# EAGLE design mega128-brd (EAGLE 6.4)
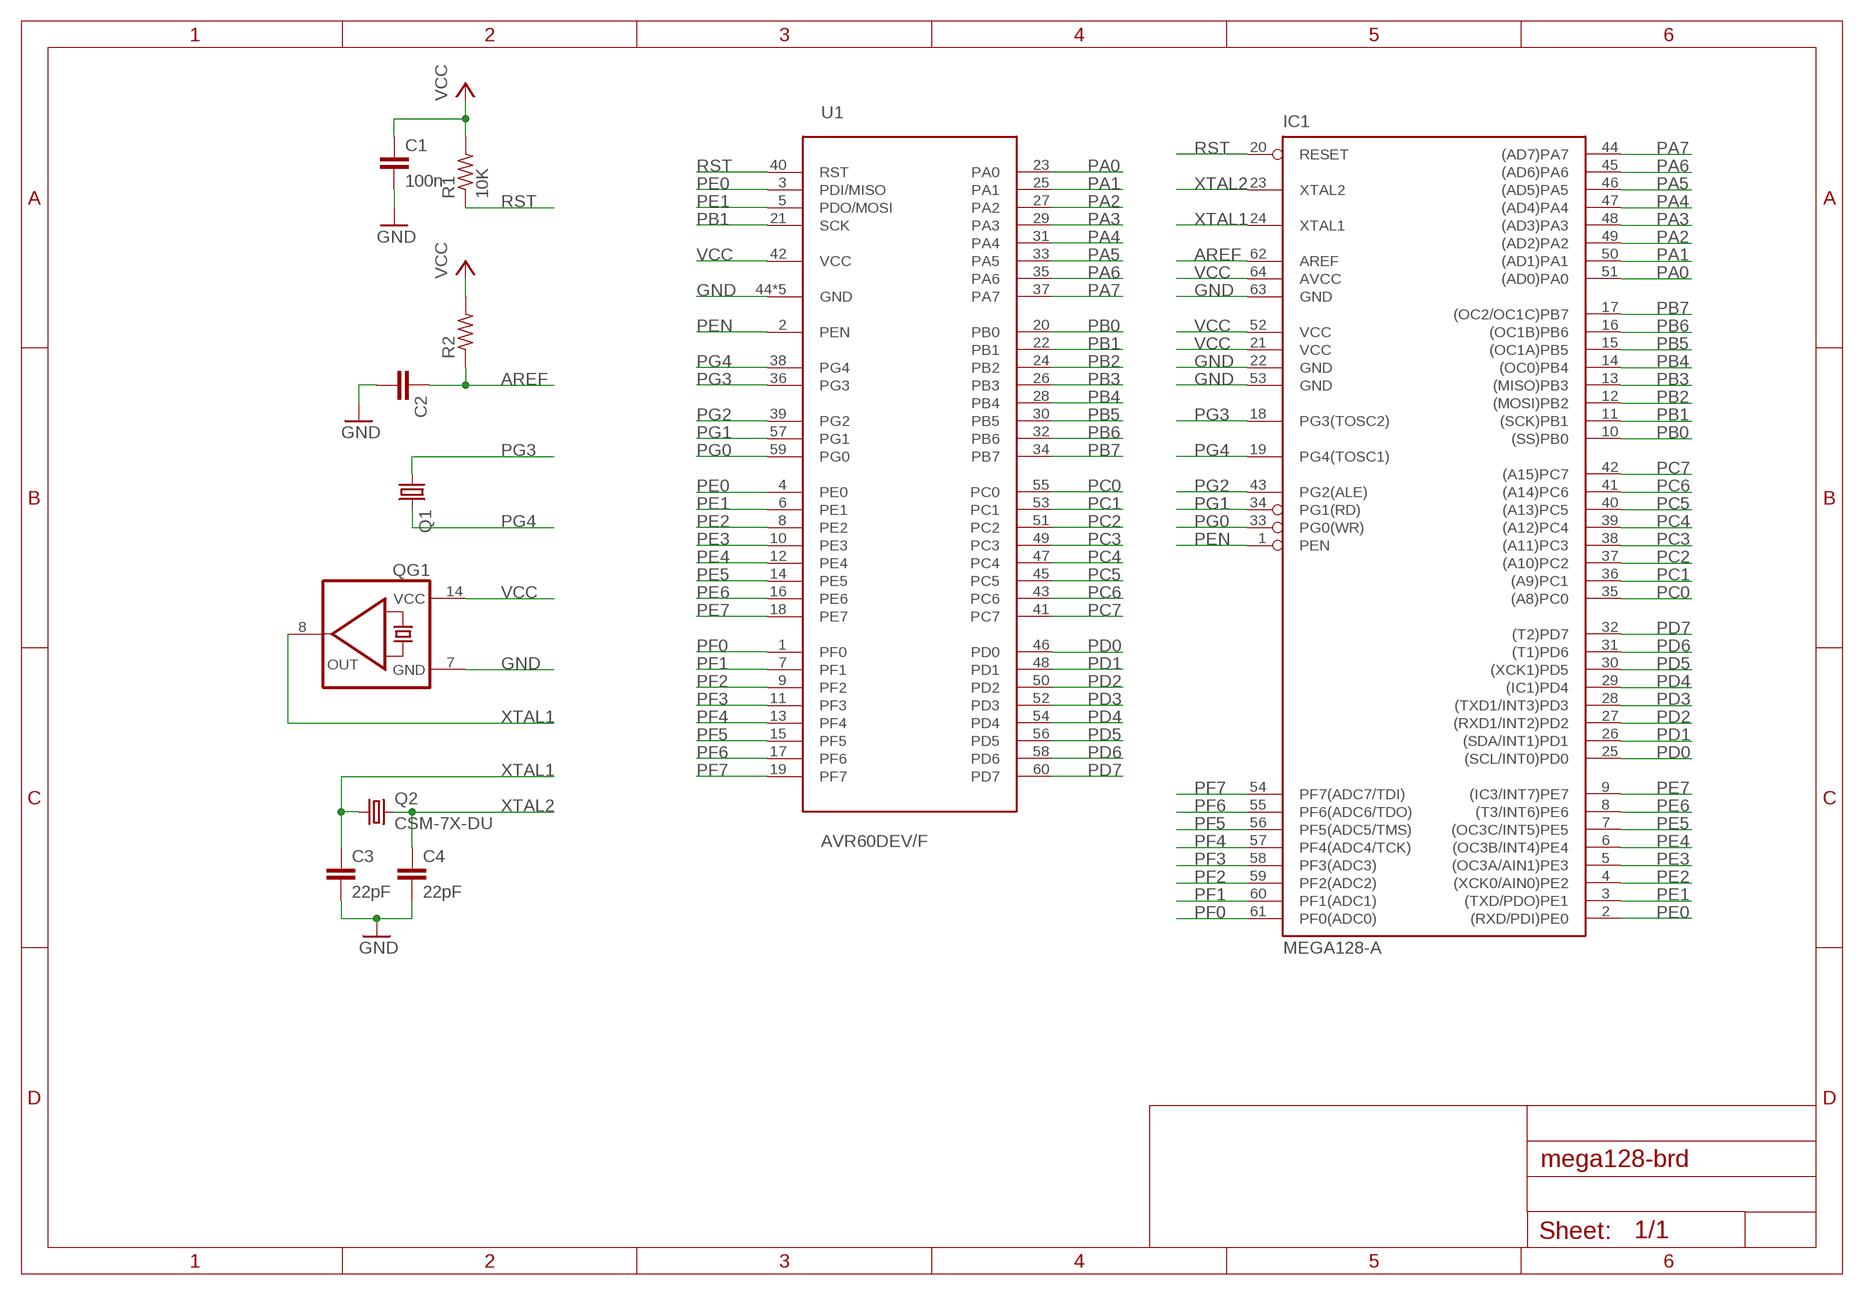
[diagram p0: schematic, sheet 1]

## Parts
C1  100n  C-EUC0805  [C0805]
C2  C-EUC0805  [C0805]
C3  22pF  C-EUC0805  [C0805]
C4  22pF  C-EUC0805  [C0805]
IC1  MEGA128-A  [TQFP64]
Q1  CRYSTALTC26V  [TC26V]
Q2  CSM-7X-DU  [CSM-7X-DU]
QG1  QG5860  [DIL14S]
R1  10K  R-US_R0805  [R0805]
R2  R-US_R0805  [R0805]
U1  AVR60DEV/F  [AVR60-DEV]

## Nets
AREF: C2.1 IC1.62(AREF) R2.1
GND: C1.2 C2.2 C3.2 C4.2 IC1.22(GND) IC1.53(GND) IC1.63(GND) QG1.7(GND) U1.44(GND) U1.61(GND) U1.62(GND) U1.63(GND) U1.64(GND)
PA0: IC1.51((AD0)PA0) U1.23(PA0)
PA1: IC1.50((AD1)PA1) U1.25(PA1)
PA2: IC1.49((AD2)PA2) U1.27(PA2)
PA3: IC1.48((AD3)PA3) U1.29(PA3)
PA4: IC1.47((AD4)PA4) U1.31(PA4)
PA5: IC1.46((AD5)PA5) U1.33(PA5)
PA6: IC1.45((AD6)PA6) U1.35(PA6)
PA7: IC1.44((AD7)PA7) U1.37(PA7)
PB0: IC1.10((SS)PB0) U1.20(PB0)
PB1: IC1.11((SCK)PB1) U1.21(SCK) U1.22(PB1)
PB2: IC1.12((MOSI)PB2) U1.24(PB2)
PB3: IC1.13((MISO)PB3) U1.26(PB3)
PB4: IC1.14((OC0)PB4) U1.28(PB4)
PB5: IC1.15((OC1A)PB5) U1.30(PB5)
PB6: IC1.16((OC1B)PB6) U1.32(PB6)
PB7: IC1.17((OC2/OC1C)PB7) U1.34(PB7)
PC0: IC1.35((A8)PC0) U1.55(PC0)
PC1: IC1.36((A9)PC1) U1.53(PC1)
PC2: IC1.37((A10)PC2) U1.51(PC2)
PC3: IC1.38((A11)PC3) U1.49(PC3)
PC4: IC1.39((A12)PC4) U1.47(PC4)
PC5: IC1.40((A13)PC5) U1.45(PC5)
PC6: IC1.41((A14)PC6) U1.43(PC6)
PC7: IC1.42((A15)PC7) U1.41(PC7)
PD0: IC1.25((SCL/INT0)PD0) U1.46(PD0)
PD1: IC1.26((SDA/INT1)PD1) U1.48(PD1)
PD2: IC1.27((RXD1/INT2)PD2) U1.50(PD2)
PD3: IC1.28((TXD1/INT3)PD3) U1.52(PD3)
PD4: IC1.29((IC1)PD4) U1.54(PD4)
PD5: IC1.30((XCK1)PD5) U1.56(PD5)
PD6: IC1.31((T1)PD6) U1.58(PD6)
PD7: IC1.32((T2)PD7) U1.60(PD7)
PE0: IC1.2((RXD/PDI)PE0) U1.3(PDI/MISO) U1.4(PE0)
PE1: IC1.3((TXD/PDO)PE1) U1.5(PDO/MOSI) U1.6(PE1)
PE2: IC1.4((XCK0/AIN0)PE2) U1.8(PE2)
PE3: IC1.5((OC3A/AIN1)PE3) U1.10(PE3)
PE4: IC1.6((OC3B/INT4)PE4) U1.12(PE4)
PE5: IC1.7((OC3C/INT5)PE5) U1.14(PE5)
PE6: IC1.8((T3/INT6)PE6) U1.16(PE6)
PE7: IC1.9((IC3/INT7)PE7) U1.18(PE7)
PEN: IC1.1(PEN) U1.2(PEN)
PF0: IC1.61(PF0(ADC0)) U1.1(PF0)
PF1: IC1.60(PF1(ADC1)) U1.7(PF1)
PF2: IC1.59(PF2(ADC2)) U1.9(PF2)
PF3: IC1.58(PF3(ADC3)) U1.11(PF3)
PF4: IC1.57(PF4(ADC4/TCK)) U1.13(PF4)
PF5: IC1.56(PF5(ADC5/TMS)) U1.15(PF5)
PF6: IC1.55(PF6(ADC6/TDO)) U1.17(PF6)
PF7: IC1.54(PF7(ADC7/TDI)) U1.19(PF7)
PG0: IC1.33(PG0(WR)) U1.59(PG0)
PG1: IC1.34(PG1(RD)) U1.57(PG1)
PG2: IC1.43(PG2(ALE)) U1.39(PG2)
PG3: IC1.18(PG3(TOSC2)) Q1.1 U1.36(PG3)
PG4: IC1.19(PG4(TOSC1)) Q1.2 U1.38(PG4)
RST: IC1.20(RESET) R1.1 U1.40(RST)
VCC: C1.1 IC1.21(VCC) IC1.52(VCC) IC1.64(AVCC) QG1.14(VCC) R1.2 R2.2 U1.42(VCC)
XTAL1: C3.1 IC1.24(XTAL1) Q2.1 QG1.8(OUT)
XTAL2: C4.1 IC1.23(XTAL2) Q2.2

## Library data of the parts
C1-C4 = rcl:C-EU: CAPACITOR, European symbol
IC1 = atmel:MEGA128: MICROCONTROLLER 128 Kbytes FLASH 4 Kbytes SRAM 4 Kbytes EEPROM DUAL USART 8-channel 10 bit ADC Source: avr.lbr; MPN: ATMEGA128-16AU; OC_FARNELL: 9171118; OC_NEWARK: 95K7364
Q1 = crystal:CRYSTAL: CRYSTAL; OC_FARNELL: unknown; OC_NEWARK: unknown
Q2 = crystal:CSM-7X-DU: SMD CRYSTAL Source: www.ecsxtal.com .. Crystal 3.6864MHz CSM_7X_DU.PDF; OC_FARNELL: unknown; OC_NEWARK: unknown
QG1 = crystal:QG5860: CRYSTAL RESONATOR; OC_FARNELL: unknown; OC_NEWARK: unknown
R1 R2 = rcl:R-US_: RESISTOR, American symbol
U1 = IyunLib:AVR60

## Board
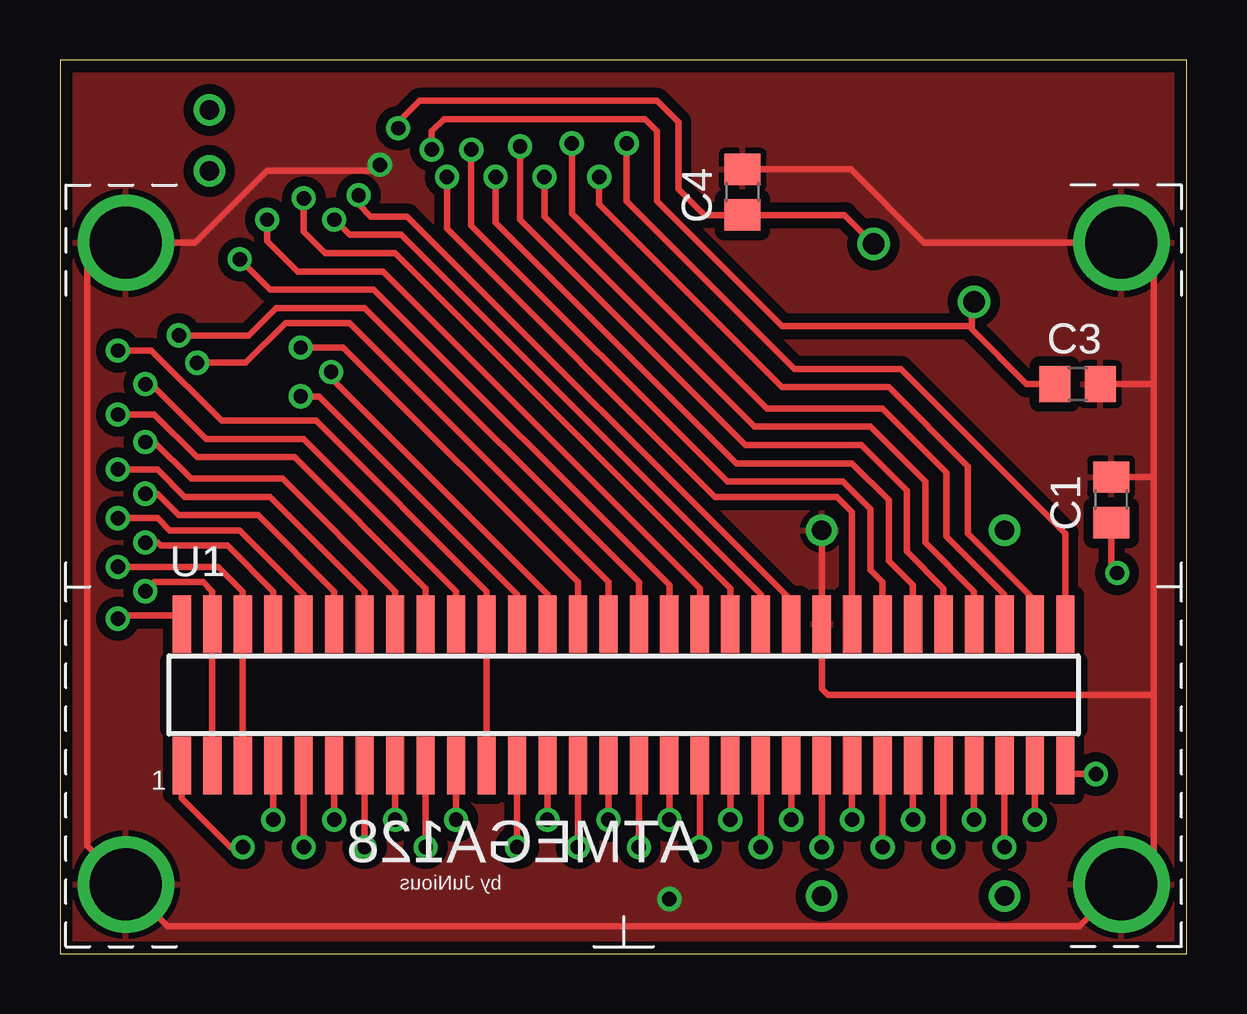
[diagram p1: board, top side]
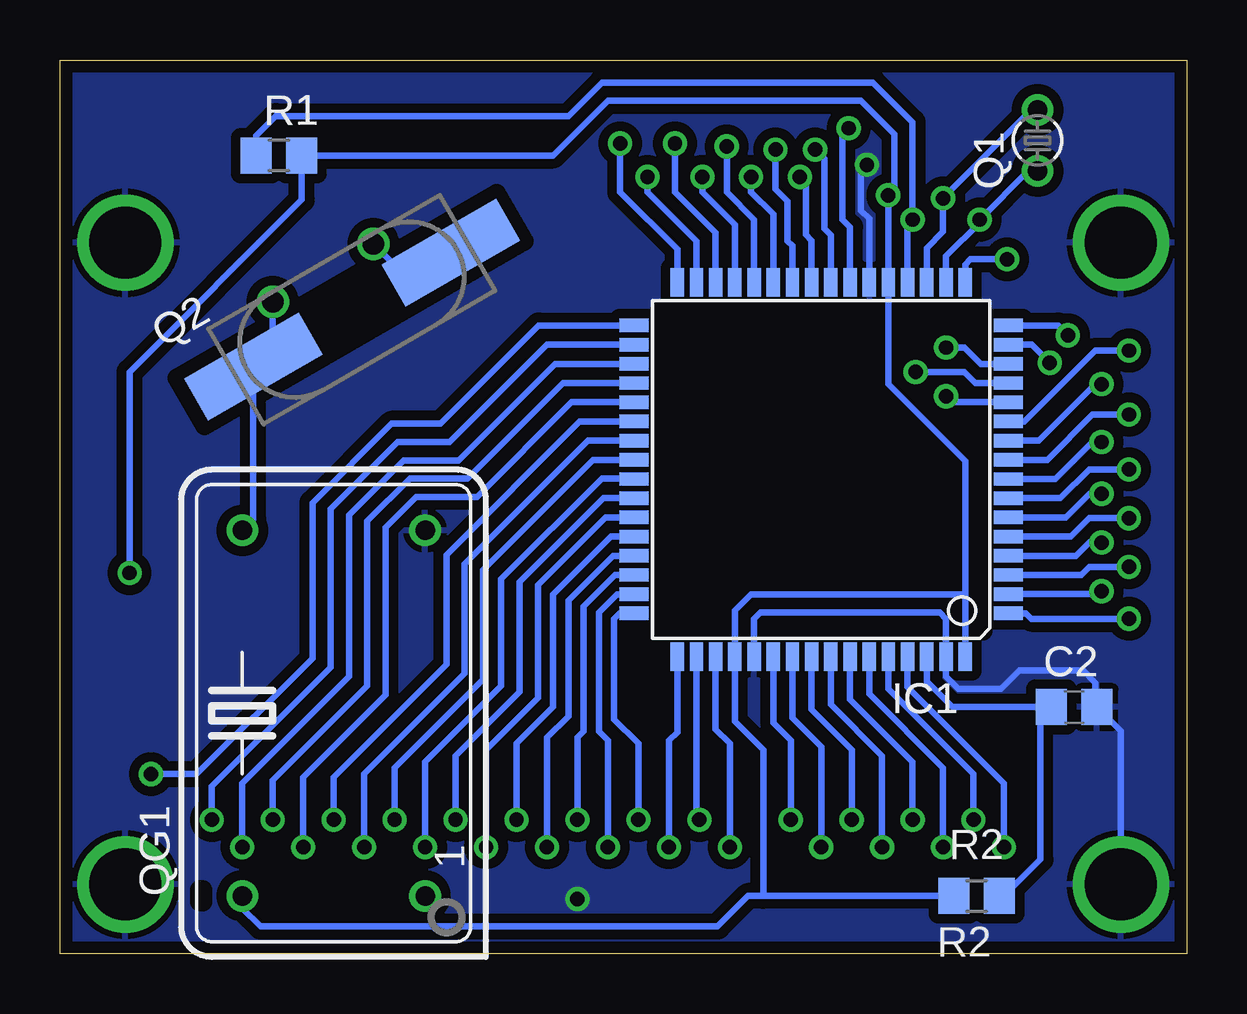
[diagram p2: board, bottom side, seen from below]

Size 46.97 x 37.26 mm. Coordinates in mm from the lower left corner, seen from the top.
Outline: 0,0 46.97,0 46.97,37.26 0,37.26 0,0
Copper layers (1*16): Top 0.035mm / dielectric 1.5mm / Bottom 0.035mm
Design rules "default *": minimum track width 10mil, minimum drill 20mil, track to track 10mil, track to pad 10mil, pad to pad 10mil, via to via 10mil, smd to smd 8mil, copper to edge 20mil, drill to drill 8mil, minimum pad ring 10mil, minimum via ring 8mil, stop-mask expansion 4mil, vias tented up to drill 0mil, thermal gap 10mil
tRestrict: area 4.6,9.4 to 42.4,12.2
bRestrict: area 8.5,13.5 to 22,26.8; area 41,2.2 to 41.1,2.7; area 27.6,22 to 42.1,31.7

### Footprints (pad centres in the part's own frame; a part is rotated, then mirrored left to right if it is on the bottom)
C0805 = smd 1.3 x 1.5: 1 -0.95,0; 2 0.95,0
TQFP64 = smd 1.194 x 0.559: 1 -7.8,6; 2 -7.8,5.2; 3 -7.8,4.4; 4 -7.8,3.6; 5 -7.8,2.8; 6 -7.8,2; 7 -7.8,1.2; 8 -7.8,0.4; 9 -7.8,-0.4; 10 -7.8,-1.2; 11 -7.8,-2; 12 -7.8,-2.8; 13 -7.8,-3.6; 14 -7.8,-4.4; 15 -7.8,-5.2; 16 -7.8,-6; 33 7.8,-6; 34 7.8,-5.2; 35 7.8,-4.4; 36 7.8,-3.6; 37 7.8,-2.8; 38 7.8,-2; 39 7.8,-1.2; 40 7.8,-0.4; 41 7.8,0.4; 42 7.8,1.2; 43 7.8,2; 44 7.8,2.8; 45 7.8,3.6; 46 7.8,4.4; 47 7.8,5.2; 48 7.8,6 | smd 0.559 x 1.194: 17 -6,-7.8; 18 -5.2,-7.8; 19 -4.4,-7.8; 20 -3.6,-7.8; 21 -2.8,-7.8; 22 -2,-7.8; 23 -1.2,-7.8; 24 -0.4,-7.8; 25 0.4,-7.8; 26 1.2,-7.8; 27 2,-7.8; 28 2.8,-7.8; 29 3.6,-7.8; 30 4.4,-7.8; 31 5.2,-7.8; 32 6,-7.8; 49 6,7.8; 50 5.2,7.8; 51 4.4,7.8; 52 3.6,7.8; 53 2.8,7.8; 54 2,7.8; 55 1.2,7.8; 56 0.4,7.8; 57 -0.4,7.8; 58 -1.2,7.8; 59 -2,7.8; 60 -2.8,7.8; 61 -3.6,7.8; 62 -4.4,7.8; 63 -5.2,7.8; 64 -6,7.8
TC26V = drill 0.813: 1 -1.27,0; 2 1.27,0
CSM-7X-DU = smd 5.5 x 2: 1 -4.75,0; 2 4.75,0
DIL14S = drill 0.813: 1 -7.62,-3.81; 7 7.62,-3.81; 8 7.62,3.81; 14 -7.62,3.81
R0805 = smd 1.3 x 1.5: 1 -0.95,0; 2 0.95,0
AVR60-DEV = smd 0.76 x 2.4: 1 -18.415,-2.95; 2 -18.415,2.95; 3 -17.145,-2.95; 4 -17.145,2.95; 5 -15.875,-2.95; 6 -15.875,2.95; 7 -14.605,-2.95; 8 -14.605,2.95; 9 -13.335,-2.95; 10 -13.335,2.95; 11 -12.065,-2.95; 12 -12.065,2.95; 13 -10.795,-2.95; 14 -10.795,2.95; 15 -9.525,-2.95; 16 -9.525,2.95; 17 -8.255,-2.95; 18 -8.255,2.95; 19 -6.985,-2.95; 20 -6.985,2.95; 21 -5.715,-2.95; 22 -5.715,2.95; 23 -4.445,-2.95; 24 -4.445,2.95; 25 -3.175,-2.95; 26 -3.175,2.95; 27 -1.905,-2.95; 28 -1.905,2.95; 29 -0.635,-2.95; 30 -0.635,2.95; 31 0.635,-2.95; 32 0.635,2.95; 33 1.905,-2.95; 34 1.905,2.95; 35 3.175,-2.95; 36 3.175,2.95; 37 4.445,-2.95; 38 4.445,2.95; 39 5.715,-2.95; 40 5.715,2.95; 41 6.985,-2.95; 42 6.985,2.95; 43 8.255,-2.95; 44 8.255,2.95; 45 9.525,-2.95; 46 9.525,2.95; 47 10.795,-2.95; 48 10.795,2.95; 49 12.065,-2.95; 50 12.065,2.95; 51 13.335,-2.95; 52 13.335,2.95; 53 14.605,-2.95; 54 14.605,2.95; 55 15.875,-2.95; 56 15.875,2.95; 57 17.145,-2.95; 58 17.145,2.95; 59 18.415,-2.95; 60 18.415,2.95 | drill 3: 61 20.75,-7.9; 62 -20.75,-7.9; 63 -20.75,18.85; 64 20.75,18.85

### Placement (x,y rotation side)
C1  43.81,18.92 90 top
C2  4.7,10.29 0 bottom
C3  42.42,23.75 0 top
C4  28.45,31.75 90 top
IC1  15.24,20.19 180 bottom
Q1  6.22,33.91 90 bottom
Q2  34.8,26.86 30 bottom
QG1  35.56,10.03 90 bottom
R1  37.85,33.27 0 bottom
R2  8.76,2.41 180 bottom
U1  23.5,10.79 0 top

### Tracks (layer width: path | path; a pad name or v marks a point on that pad's centre or on a via)
AREF
  Bottom 0.28: C2.1 6.22,10.29 | 6.22,10.29 9.78,10.29 10.84,11.35 IC1.62 | R2.1 7.62,2.41 6.1,3.94 6.1,10.16 6.22,10.29
GND  (via drill 0.6)
  Top 0.28: 45.59,23.88 45.59,28.7 44.65,29.64 U1.64 36.01,29.64 32.96,32.7 C4.2 | 45.59,23.88 45.59,19.94 | 45.59,19.94 45.59,10.79 | 45.59,10.79 45.59,4.24 U1.61 42.49,1.14 4.5,1.14 U1.62 1.14,4.5 1.14,28.57 2.21,29.64 U1.63 5.64,29.64 8.64,32.64 13.08,32.64 v13.34,32.89 | C3.2 45.47,23.75 45.59,23.88 | C1.2 45.53,19.87 45.59,19.94 | 45.59,10.79 32,10.79 31.75,11.05 U1.44 QG1.7
  Bottom 0.28: IC1.53 18.04,13.33 18.03,13.34 18.03,13.97 17.78,14.22 10.29,14.22 10.03,13.97 IC1.63 | IC1.63 | IC1.63 10.03,11.56 9.53,11.05 7.75,11.05 6.99,11.81 4.32,11.81 3.81,11.3 3.81,10.35 C2.2 2.75,9.28 U1.62 | IC1.22 13.24,30.64 13.59,30.99 13.59,32.64 v13.34,32.89
  other vias: 25.4,2.29
  pour Top (isolate 0.406): 0.25,36.96 46.74,36.96 46.74,0.25 0.25,0.25
  pour Bottom (isolate 0.406): 0.25,36.96 46.74,36.96 46.74,0.25 0.25,0.25
PA0  (via drill 0.6)
  Top 0.28: U1.23 v19.05,4.45
  Bottom 0.28: v19.05,4.45 19.05,8.76 19.64,9.35 IC1.51
PA1  (via drill 0.6)
  Top 0.28: U1.25 v20.32,5.59
  Bottom 0.28: v20.32,5.59 20.44,5.71 IC1.50
PA2  (via drill 0.6)
  Top 0.28: U1.27 v21.59,4.45
  Bottom 0.28: v21.59,4.45 21.59,8.89 21.24,9.24 IC1.49
PA3  (via drill 0.6)
  Top 0.28: U1.29 v22.86,5.59
  Bottom 0.28: v22.86,5.59 22.86,8.76 23.88,9.78 23.88,13.97 23.65,14.19 IC1.48
PA4  (via drill 0.6)
  Top 0.28: U1.31 v24.13,4.45
  Bottom 0.28: v24.13,4.45 24.13,8.89 24.51,9.27 24.51,14.22 23.75,14.99 IC1.47
PA5  (via drill 0.6)
  Top 0.28: U1.33 v25.4,5.59
  Bottom 0.28: v25.4,5.59 25.4,9.02 25.15,9.27 25.15,14.48 23.83,15.79 IC1.46
PA6  (via drill 0.6)
  Top 0.28: U1.35 v26.67,4.45
  Bottom 0.28: v26.67,4.45 26.67,9.02 25.78,9.91 25.78,14.73 23.92,16.59 IC1.45
PA7  (via drill 0.6)
  Top 0.28: U1.37 v27.94,5.59
  Bottom 0.28: v27.94,5.59 27.94,8.76 26.42,10.29 26.42,14.99 24.01,17.39 IC1.44
PB0  (via drill 0.6)
  Top 0.28: v3.56,23.75 3.81,23.75 6.1,21.46 10.16,21.46 16.51,15.11 U1.20
  Bottom 0.28: IC1.10 6.17,21.39 3.81,23.75 v3.56,23.75
PB1  (via drill 0.6)
  Top 0.28: U1.21 U1.22 17.78,15.11 10.67,22.23 6.73,22.23 3.81,25.15 v2.41,25.15
  Bottom 0.28: IC1.11 6.76,22.19 3.81,25.15 v2.41,25.15
PB2  (via drill 0.6)
  Top 0.28: v10.03,23.24 10.79,23.24 19.05,14.99 U1.24
  Bottom 0.28: IC1.12 9.79,22.99 v10.03,23.24
PB3  (via drill 0.6)
  Top 0.28: U1.26 20.32,14.99 11.3,24 v11.3,24.26
  Bottom 0.28: v11.3,24.26 9.27,24.26 8.81,23.79 IC1.13
PB4  (via drill 0.6)
  Top 0.28: U1.28 21.59,15.49 11.81,25.27 v10.03,25.27
  Bottom 0.28: IC1.14 8.59,24.59 9.27,25.27 v10.03,25.27
PB5  (via drill 0.6)
  Top 0.28: v5.71,24.64 7.75,24.64 9.4,26.29 12.06,26.29 22.86,15.49 U1.30
  Bottom 0.28: IC1.15 6.47,25.39 v5.71,24.64
PB6  (via drill 0.6)
  Top 0.28: v4.95,25.78 7.87,25.78 9.02,26.92 12.7,26.92 24.13,15.49 U1.32
  Bottom 0.28: IC1.16 5.37,26.19 v4.95,25.78
PB7  (via drill 0.6)
  Top 0.28: U1.34 25.4,15.37 13.08,27.69 8.76,27.69 v7.49,28.96
  Bottom 0.28: IC1.17 9.24,28.73 9.02,28.96 v7.49,28.96
PC0  (via drill 0.6)
  Top 0.28: U1.55 v39.37,4.45
  Bottom 0.28: v39.37,4.45 39.37,7.11 34.92,11.56 34.92,18.29 32.64,20.57 30.35,20.57 26.33,24.59 IC1.35
PC1  (via drill 0.6)
  Top 0.28: U1.53 v38.1,5.59
  Bottom 0.28: v38.1,5.59 38.1,7.24 34.16,11.18 34.16,18.03 32.38,19.81 29.97,19.81 25.99,23.79 IC1.36
PC2  (via drill 0.6)
  Top 0.28: U1.51 v36.83,4.45
  Bottom 0.28: v36.83,4.45 36.83,7.37 33.4,10.79 33.4,17.78 32.13,19.05 29.59,19.05 25.65,22.99 IC1.37
PC3  (via drill 0.6)
  Top 0.28: U1.49 v35.56,5.59
  Bottom 0.28: v35.56,5.59 35.56,7.37 30.86,12.06 30.86,16.64 25.3,22.19 IC1.38
PC4  (via drill 0.6)
  Top 0.28: U1.47 v34.29,4.45
  Bottom 0.28: v34.29,4.45 34.29,7.49 30.1,11.68 30.1,16.26 24.96,21.39 IC1.39
PC5  (via drill 0.6)
  Top 0.28: U1.45 v33.02,5.59
  Bottom 0.28: v33.02,5.59 33.02,7.75 29.34,11.43 29.34,16 24.75,20.59 IC1.40
PC6  (via drill 0.6)
  Top 0.28: U1.43 v31.75,4.45
  Bottom 0.28: v31.75,4.45 31.75,8 28.57,11.18 28.57,15.62 24.38,19.81 23.06,19.81 IC1.41
PC7  (via drill 0.6)
  Top 0.28: U1.41 v30.48,5.59
  Bottom 0.28: v30.48,5.59 30.48,8.26 27.81,10.92 27.81,15.49 24.31,18.99 IC1.42
PD0  (via drill 0.6)
  Top 0.28: v16.13,32.38 16.13,30.23 27.3,19.05 32.38,19.05 33.02,18.41 U1.46
  Bottom 0.28: IC1.25 15.64,29.74 15.88,29.97 15.88,32.13 v16.13,32.38
PD1  (via drill 0.6)
  Top 0.28: v17.14,33.53 17.14,30.35 27.81,19.68 32.64,19.68 33.78,18.54 33.78,16 34.29,15.49 U1.48
  Bottom 0.28: v17.14,33.53 17.14,31.88 16.64,31.37 16.64,29.72 16.44,29.52 IC1.26
PD2  (via drill 0.6)
  Top 0.28: v18.16,32.38 18.16,30.48 28.19,20.45 33.02,20.45 34.54,18.92 34.54,16.38 35.56,15.37 U1.50
  Bottom 0.28: v18.16,32.38 18.16,31.75 17.24,30.83 IC1.27
PD3  (via drill 0.6)
  Top 0.28: v19.18,33.66 19.18,30.61 28.57,21.21 33.4,21.21 35.31,19.3 35.31,16.76 36.83,15.24 U1.52
  Bottom 0.28: v19.18,33.66 19.18,31.75 18.04,30.61 IC1.28
PD4  (via drill 0.6)
  Top 0.28: v20.19,32.38 20.19,30.73 28.96,21.97 33.78,21.97 36.07,19.68 36.07,17.14 38.1,15.11 U1.54
  Bottom 0.28: v20.19,32.38 20.19,31.75 18.84,30.4 IC1.29
PD5  (via drill 0.6)
  Top 0.28: U1.56 39.37,14.99 36.96,17.4 36.96,20.07 34.29,22.73 29.46,22.73 21.34,30.86 v21.34,33.78
  Bottom 0.28: v21.34,33.78 21.34,31.75 19.64,30.05 IC1.30
PD6  (via drill 0.6)
  Top 0.28: U1.58 40.64,14.73 37.85,17.53 37.85,20.32 34.54,23.62 30.1,23.62 22.48,31.24 v22.48,32.38
  Bottom 0.28: v22.48,32.38 22.48,31.75 20.44,29.71 IC1.31
PD7  (via drill 0.6)
  Top 0.28: U1.60 41.91,17.53 35.05,24.38 30.61,24.38 23.62,31.37 v23.62,33.78
  Bottom 0.28: v23.62,33.78 23.62,31.75 21.24,29.37 IC1.32
PE0  (via drill 0.6)
  Top 0.28: U1.3 U1.4 6.35,15.11 5.97,15.49 3.94,15.49 v3.56,15.11
  Bottom 0.28: v3.56,15.11 3.68,14.99 IC1.2
PE1  (via drill 0.6)
  Top 0.28: U1.5 U1.6 7.62,15.11 6.6,16.13 v2.41,16.13
  Bottom 0.28: IC1.3 4.4,15.79 4.06,16.13 v2.41,16.13
PE2  (via drill 0.6)
  Top 0.28: U1.8 8.89,15.11 6.99,17.02 4.19,17.02 4.06,17.14 v3.56,17.14
  Bottom 0.28: IC1.4 4.62,16.59 4.06,17.14 v3.56,17.14
PE3  (via drill 0.6)
  Top 0.28: U1.10 10.16,14.99 7.49,17.65 4.57,17.65 4.06,18.16 v2.41,18.16
  Bottom 0.28: IC1.5 4.83,17.39 4.06,18.16 v2.41,18.16
PE4  (via drill 0.6)
  Top 0.28: U1.12 11.43,15.11 8.26,18.29 4.95,18.29 4.06,19.18 v3.56,19.18
  Bottom 0.28: IC1.6 5.05,18.19 4.06,19.18 v3.56,19.18
PE5  (via drill 0.6)
  Top 0.28: v2.41,20.19 4.06,20.19 5.21,19.05 8.76,19.05 12.7,15.11 U1.14
  Bottom 0.28: IC1.7 5.26,18.99 4.06,20.19 v2.41,20.19
PE6  (via drill 0.6)
  Top 0.28: v3.56,21.34 3.94,21.34 5.46,19.81 9.27,19.81 13.97,15.11 U1.16
  Bottom 0.28: IC1.8 5.48,19.79 3.94,21.34 v3.56,21.34
PE7  (via drill 0.6)
  Top 0.28: v2.41,22.48 3.94,22.48 5.71,20.7 9.78,20.7 15.24,15.24 U1.18
  Bottom 0.28: IC1.9 5.82,20.59 3.94,22.48 v2.41,22.48
PEN  (via drill 0.6)
  Top 0.28: U1.2 arc-60 5.08,14.35 4.83,14.1 2.54,14.1 v2.41,13.97
  Bottom 0.28: IC1.1 6.7,14.19 6.48,13.97 v2.41,13.97
PF0  (via drill 0.6)
  Top 0.28: U1.1 5.08,6.48 7.11,4.45 v7.62,4.45
  Bottom 0.28: IC1.61 11.64,11.13 7.62,7.11 v7.62,4.45
PF1  (via drill 0.6)
  Top 0.28: U1.7 v8.89,5.59
  Bottom 0.28: IC1.60 12.44,11.04 8.89,7.49 v8.89,5.59
PF2  (via drill 0.6)
  Top 0.28: U1.9 v10.16,4.45
  Bottom 0.28: IC1.59 13.24,10.83 10.16,7.75 v10.16,4.45
PF3  (via drill 0.6)
  Top 0.28: U1.11 v11.43,5.59
  Bottom 0.28: v11.43,5.59 11.43,8 14.04,10.61 IC1.58
PF4  (via drill 0.6)
  Top 0.28: U1.13 v12.7,4.45
  Bottom 0.28: v12.7,4.45 12.7,8.26 14.84,10.39 IC1.57
PF5  (via drill 0.6)
  Top 0.28: U1.15 v13.97,5.59
  Bottom 0.28: v13.97,5.59 13.97,8.51 15.64,10.18 IC1.56
PF6  (via drill 0.6)
  Top 0.28: U1.17 v15.24,4.45
  Bottom 0.28: v15.24,4.45 15.24,8.64 16.44,9.84 IC1.55
PF7  (via drill 0.6)
  Top 0.28: U1.19 v16.51,5.59
  Bottom 0.28: v16.51,5.59 16.51,8.89 17.24,9.62 IC1.54
PG0  (via drill 0.6)
  Top 0.28: U1.59 42.26,7.49 v43.18,7.49
  Bottom 0.28: v43.18,7.49 41.27,7.49 36.45,12.32 36.45,18.8 33.15,22.1 31.11,22.1 27.02,26.19 IC1.33
PG1  (via drill 0.6)
  Top 0.28: v40.64,5.59 U1.57
  Bottom 0.28: IC1.34 26.68,25.39 30.73,21.34 32.89,21.34 35.69,18.54 35.69,11.94 40.64,6.99 v40.64,5.59
PG2  (via drill 0.6)
  Top 0.28: U1.39 v29.21,4.45
  Bottom 0.28: v29.21,4.45 29.21,8.51 27.05,10.67 27.05,15.37 24.23,18.19 IC1.43
PG3  (via drill 0.6)
  Top 0.28: U1.36 26.67,15.24 13.46,28.45 9.91,28.45 8.64,29.72 v8.64,30.61 8.64,30.48
  Bottom 0.28: IC1.18 10.04,29.08 8.64,30.48 v8.64,30.61 6.6,32.64 Q1.1
PG4  (via drill 0.6)
  Top 0.28: U1.38 27.94,15.24 13.97,29.21 11.05,29.21 10.16,30.1 v10.16,31.5
  Bottom 0.28: IC1.19 10.84,29.42 10.16,30.1 v10.16,31.5 6.48,35.18 Q1.2
RST  (via drill 0.6)
  Top 0.28: U1.40 29.21,14.99 14.22,29.97 12.06,29.97 v11.43,30.61
  Bottom 0.28: IC1.20 11.64,30.4 v11.43,30.61 11.43,34.67 13.08,36.32 24.38,36.32 25.78,34.92 37.97,34.92 38.8,34.1 R1.1
VCC  (via drill 0.6)
  Top 0.28: U1.42 30.48,14.73 14.48,30.73 12.95,30.73 12.45,31.24 v12.45,31.62 | C1.1 43.81,16.13 v44.07,15.88
  Bottom 0.28: IC1.64 9.24,14.99 | 9.24,14.99 9.24,20.54 12.44,23.74 IC1.21 v12.45,31.62 12.19,31.88 12.19,34.16 13.59,35.56 24.13,35.56 26.42,33.27 R1.2 36.9,31.43 44.07,24.26 v44.07,15.88 | 17.65,2.41 17.65,8.51 18.84,9.7 IC1.52 18.84,14.31 18.16,14.99 9.24,14.99 | QG1.14 39.37,1.91 38.61,1.14 19.56,1.14 18.29,2.41 17.65,2.41 | R2.2 17.65,2.41
XTAL1  (via drill 0.6, 0.9)
  Top 0.28: C3.1 40.29,23.75 38,26.04 38,26.16 | v15.49,33.53 15.49,34.29 16,34.8 24.38,34.8 24.89,34.29 24.89,31.37 30.1,26.16 38,26.16 | v38.1,27.18 38,27.08 38,26.16
  Bottom 0.28: IC1.24 14.84,29.95 15.11,30.23 15.11,33.15 v15.49,33.53 | QG1.8 38.91,18.11 Q2.1 38,25.39 38.1,25.49 v38.1,27.18
XTAL2  (via drill 0.6, 0.9)
  Top 0.28: v14.1,34.42 14.1,34.67 14.99,35.56 24.89,35.56 25.78,34.67 25.78,31.88 26.86,30.8 C4.1 32.7,30.8 v33.91,29.59
  Bottom 0.28: IC1.23 14.04,30.3 14.35,30.61 14.35,34.16 v14.1,34.42 | Q2.2 32.24,29.23 33.15,28.32 33.15,28.84 v33.9,29.59 v33.91,29.59

### Text on the board
_tNames: C4 | C3 | C1 | U1 | ATMEGA128 | by JuNious
_bNames: R1 | Q1 | Q2 | C2 | IC1 | R2 | QG1